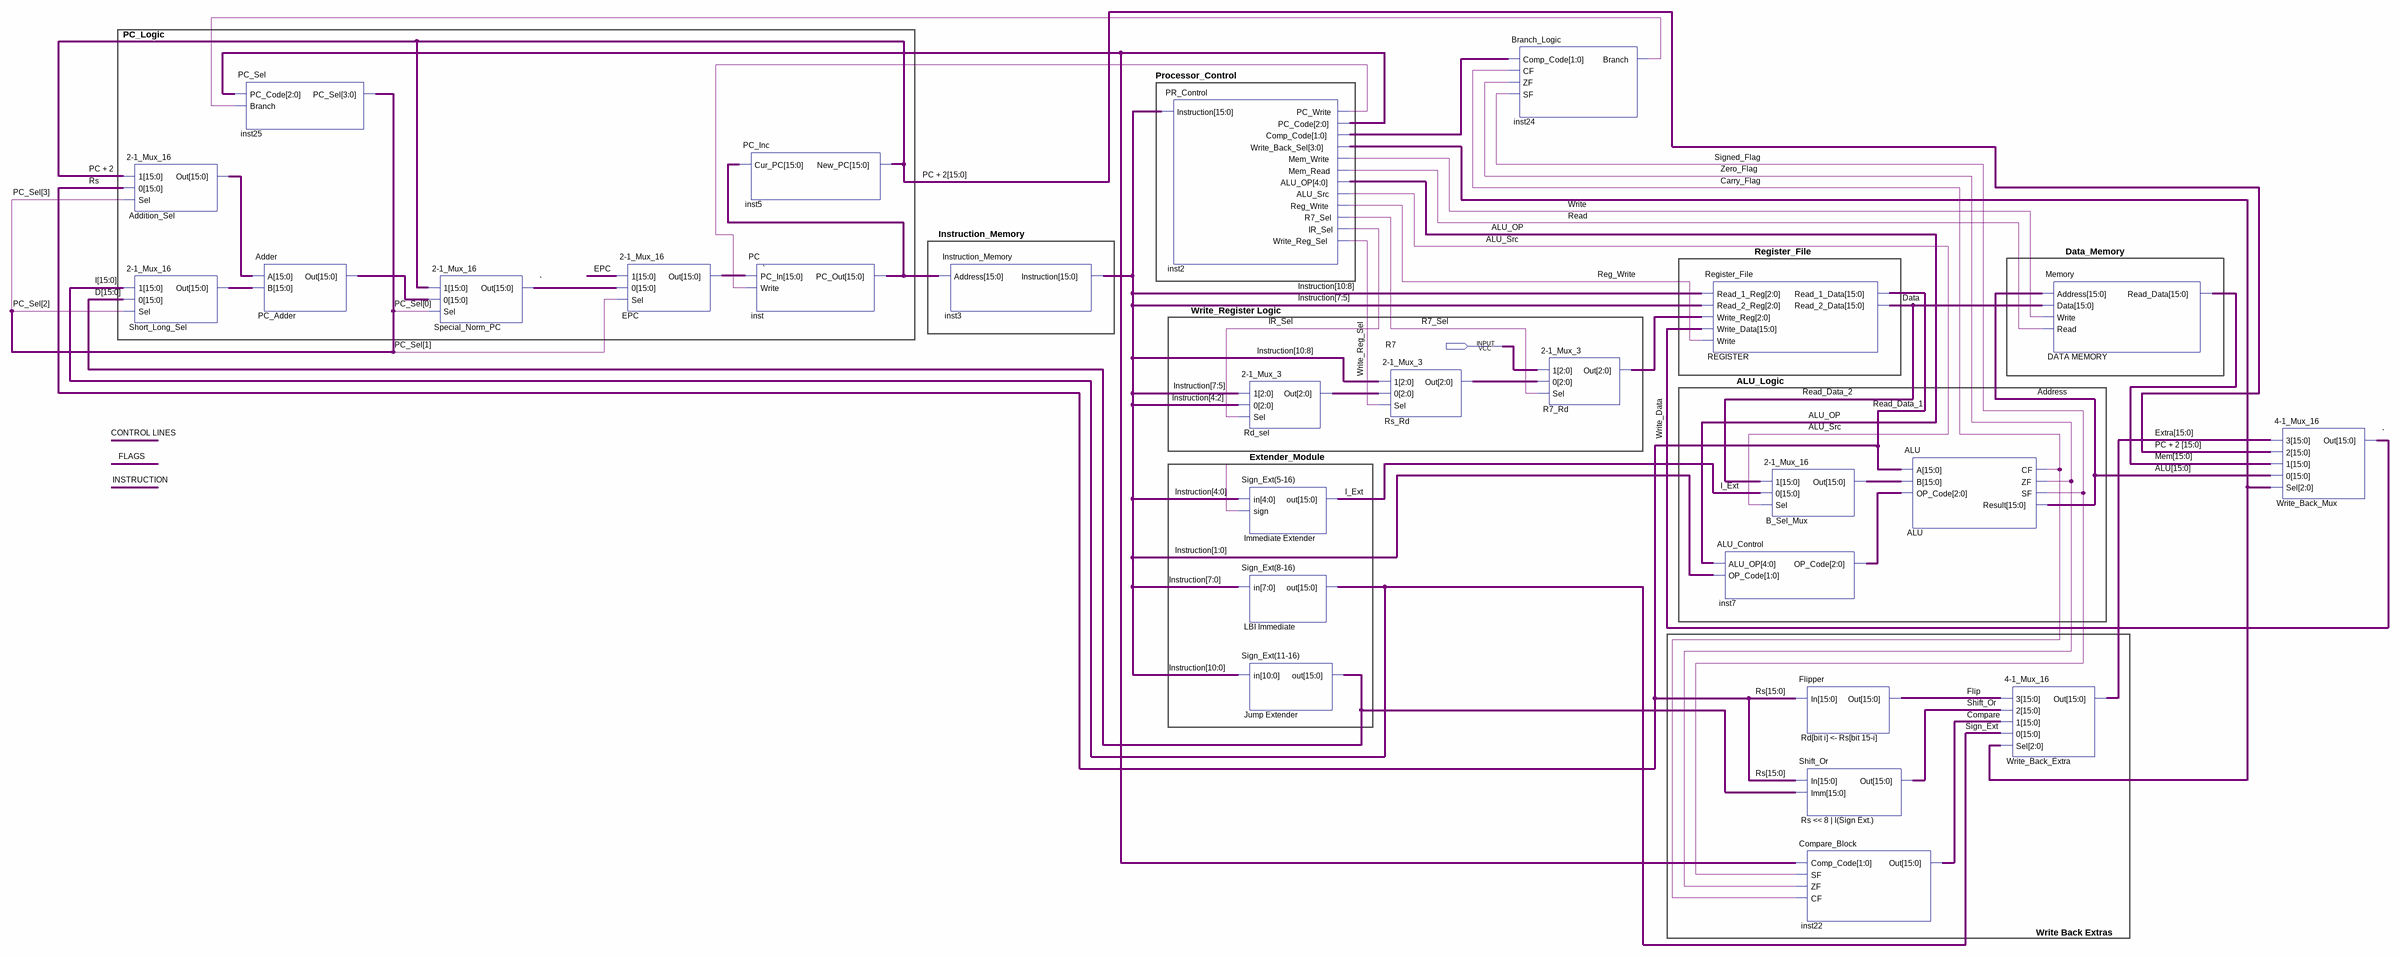
[diagram p0: schematic sheet]
// Quartus schematic Processor(Mitchell).bdf as structural Verilog: 27 symbols, 1 pins
module \Processor(Mitchell)  (
  input  R7
);

  wire \` , Address, ALU_OP, ALU_Src, Carry_Flag, Compare, Data, EPC, Flip, I_Ext, inst2_pc_write,
       inst24_branch, IR_Sel, \PC_+_2_1bit , R7_Sel, Read, Read_Data_1, Read_Data_2, Reg_Write, Rs_1bit,
       Shift_Or, Sign_Ext, Signed_Flag, undriven_2, Write, Write_Data, Write_Reg_Sel, Zero_Flag;
  wire [1:0] inst2_comp_code;
  wire [2:0] inst2_pc_code, inst7_op_code, R7_Rd_out, Rd_sel_out, Rs_Rd_out, undriven;
  wire [3:0] inst2_write_back_sel, inst25_pc_sel, PC_Sel;
  wire [10:0] Instruction;
  wire [15:0] Addition_Sel_out, ALU, B_Sel_Mux_out, D, Extra, I, inst_pc_out, Mem, \PC_+_2 , PC_Adder_out,
       Rs, Short_Long_Sel_out;

  \2-1_Mux_16  Addition_Sel (.\1 ({16{\PC_+_2_1bit }}), .\0 ({16{Rs_1bit}}), .Sel(PC_Sel[3]), .Out(Addition_Sel_out));
  \2-1_Mux_16  Short_Long_Sel (.\1 (I), .\0 (D), .Sel(PC_Sel[2]), .Out(Short_Long_Sel_out));
  PC_Sel inst25 (.PC_Code(inst2_pc_code), .Branch(inst24_branch), .PC_Sel(inst25_pc_sel));
  Adder PC_Adder (.A(Addition_Sel_out), .B(Short_Long_Sel_out), .Out(PC_Adder_out));
  \2-1_Mux_16  Special_Norm_PC (.\1 (\PC_+_2 ), .\0 (PC_Adder_out), .Sel(PC_Sel[0]), .Out(\` ));
  \2-1_Mux_16  u_EPC (.\1 ({16{EPC}}), .\0 ({16{\` }}), .Sel(PC_Sel[1]), .Out(\` ));
  PC_Inc inst5 (.Cur_PC(inst_pc_out), .New_PC(\PC_+_2 ));
  PC inst (.PC_In({16{\` }}), .Write(inst2_pc_write), .PC_Out(inst_pc_out));
  Instruction_Memory inst3 (.Address(inst_pc_out), .Instruction(Instruction));
  PR_Control inst2 (
    .Instruction(Instruction), .PC_Write(inst2_pc_write), .PC_Code(inst2_pc_code),
    .Comp_Code(inst2_comp_code), .Write_Back_Sel(inst2_write_back_sel), .Mem_Write(Write), .Mem_Read(Read),
    .ALU_OP(ALU_OP), .ALU_Src(ALU_Src), .Reg_Write(Reg_Write), .R7_Sel(R7_Sel), .IR_Sel(IR_Sel),
    .Write_Reg_Sel(Write_Reg_Sel));
  \2-1_Mux_3  Rd_sel (.\1 (Instruction[7:5]), .\0 (Instruction[4:2]), .Sel(IR_Sel), .Out(Rd_sel_out));
  \Sign_Ext(5-16)  \Immediate_Extender  (.in(Instruction[4:0]), .sign(undriven_2), .out(I_Ext));
  \Sign_Ext(8-16)  \LBI_Immediate  (.in(Instruction[7:0]), .out(I));
  \Sign_Ext(11-16)  \Jump_Extender  (.in(Instruction), .out(D));
  \2-1_Mux_3  Rs_Rd (.\1 (Instruction[10:8]), .\0 (Rd_sel_out), .Sel(Write_Reg_Sel), .Out(Rs_Rd_out));
  Branch_Logic inst24 (
    .Comp_Code(inst2_comp_code), .CF(Carry_Flag), .ZF(Zero_Flag), .SF(Signed_Flag), .Branch(inst24_branch));
  \2-1_Mux_3  R7_Rd (.\1 (undriven), .\0 (Rs_Rd_out), .Sel(R7_Sel), .Out(R7_Rd_out));
  Register_File REGISTER (
    .Read_1_Reg(Instruction[10:8]), .Read_2_Reg(Instruction[7:5]), .Write_Reg(R7_Rd_out),
    .Write_Data({16{Write_Data}}), .Write(Reg_Write), .Read_1_Data(Read_Data_1), .Read_2_Data(Data));
  ALU_Control inst7 (
    .ALU_OP({5{ALU_OP}}),
    .OP_Code({inst7_op_code[2], Instruction[1], inst7_op_code[1], Instruction[0], inst7_op_code[0]}));
  \2-1_Mux_16  B_Sel_Mux (.\1 ({16{Read_Data_2}}), .\0 ({16{I_Ext}}), .Sel(ALU_Src), .Out(B_Sel_Mux_out));
  Flipper \Rd[bit_i]_<-_Rs[bit_15-i]  (.In(Rs), .Out(Flip));
  Shift_Or \Rs_<<_8_|_I(Sign_Ext.)  (.In(Rs), .Imm(D), .Out(Shift_Or));
  Compare_Block inst22 (.Comp_Code(inst2_pc_code), .SF(Signed_Flag), .ZF(Zero_Flag), .CF(Carry_Flag), .Out(Compare));
  ALU u_ALU (
    .A(Rs), .B(B_Sel_Mux_out), .OP_Code(inst7_op_code), .CF(Carry_Flag), .ZF(Zero_Flag), .SF(Signed_Flag),
    .Result(ALU));
  \4-1_Mux_16  Write_Back_Extra (
    .\3 ({16{Flip}}), .\2 ({16{Shift_Or}}), .\1 ({16{Compare}}), .\0 ({16{Sign_Ext}}),
    .Sel(inst2_write_back_sel), .Out(Extra));
  Memory \DATA_MEMORY  (.Address({16{Address}}), .Data({16{Read_Data_2}}), .Write(Write), .Read(Read), .Read_Data(Mem));
  \4-1_Mux_16  Write_Back_Mux (
    .\3 (Extra), .\2 (\PC_+_2 ), .\1 (Mem), .\0 (ALU), .Sel(inst2_write_back_sel), .Out(\` ));

  // Notes on the sheet:
  //   PC_Logic
  //   Processor_Control
  //   Instruction_Memory
  //   Register_File
  //   Data_Memory
  //   Write_Register Logic
  //   ALU_Logic
  //   Extender_Module
  //   Write Back Extras
endmodule
